# Altium project uz_per_wolfspeed_25kw_FM3.PrjPcb (part 2 of 2)

## Sheet Power.SchDoc
size A4; Organization: UltraZohm; DocumentNumber: 8; SheetNumber: 8; SheetTotal: 11; Website: www.ultrazohm.com
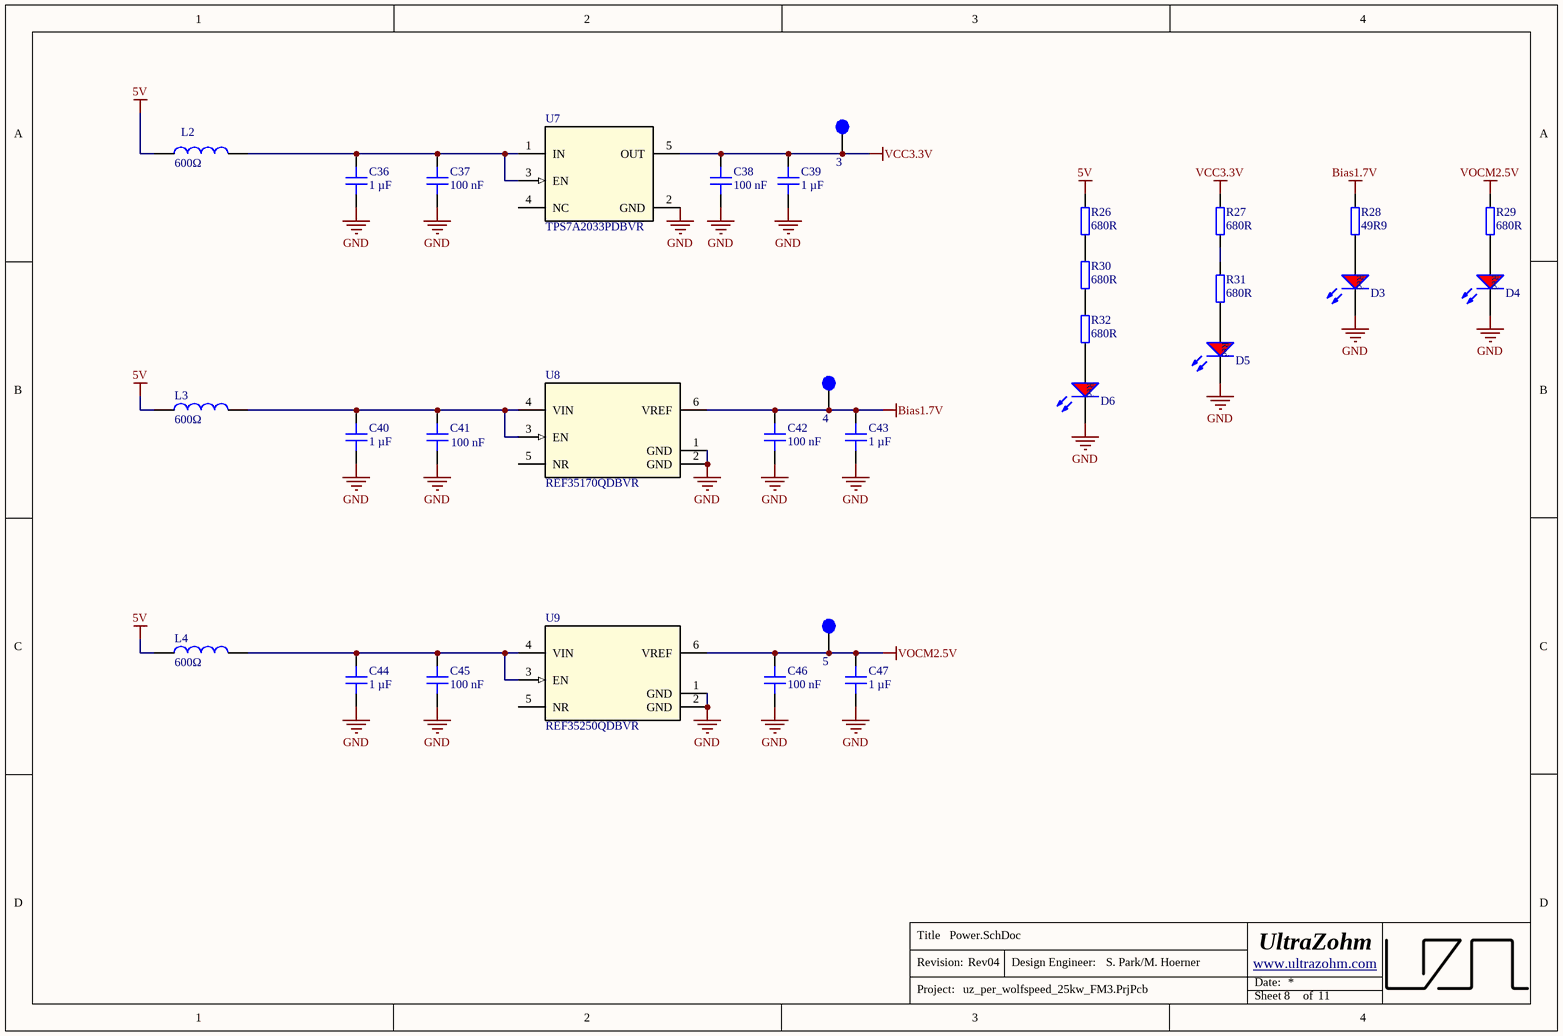
[diagram p6: Power.SchDoc]

### Parts
3  Testpoint 1mm  [TP_1mm]  (value not drawn)  (no BOM)
4  Testpoint 1mm  [TP_1mm]  (value not drawn)  (no BOM)
5  Testpoint 1mm  [TP_1mm]  (value not drawn)  (no BOM)
C36  1 µF  [C_0603]
C37  100 nF  [C_0603]
C38  100 nF  [C_0603]
C39  1 µF  [C_0603]
C40  1 µF  [C_0603]
C41  100 nF  [C_0603]
C42  100 nF  [C_0603]
C43  1 µF  [C_0603]
C44  1 µF  [C_0603]
C45  100 nF  [C_0603]
C46  100 nF  [C_0603]
C47  1 µF  [C_0603]
D3  150060RS75000  [WL-SMCW_0603]  (value not drawn)
D4  150060RS75000  [WL-SMCW_0603]  (value not drawn)
D5  150060RS75000  [WL-SMCW_0603]  (value not drawn)
D6  150060RS75000  [WL-SMCW_0603]  (value not drawn)
L2  600Ω  [WE-CBF_0805_High Current]
L3  600Ω  [WE-CBF_0805_High Current]
L4  600Ω  [WE-CBF_0805_High Current]
R26  680R  [R_0603_N]
R27  680R  [R_0603_N]
R28  49R9  [RES 0603_1608]
R29  680R  [R_0603_N]
R30  680R  [R_0603_N]
R31  680R  [R_0603_N]
R32  680R  [R_0603_N]
U7  TPS7A2033PDBVR  [DBV0005A-IPC_A]
U8  REF35170QDBVR  [DBV0006A-IPC_A]
U9  REF35250QDBVR  [DBV0006A-IPC_A]

### Nets
5V: L2.1 L3.1 L4.1 R26.2
Bias1.7V: 4.1 C42.1 C43.1 R28.1 U8.6(VREF)
GND: C36.2 C37.2 C38.2 C39.2 C40.2 C41.2 C42.2 C43.2 C44.2 C45.2 C46.2 C47.2 D3.1(K) D4.1(K) D5.1(K) D6.1(K) U7.2(GND) U8.1(GND) U8.2(GND) U9.1(GND) U9.2(GND)
VCC3.3V: 3.1 C38.1 C39.1 R27.2 U7.5(OUT)
VOCM2.5V: 5.1 C46.1 C47.1 R29.2 U9.6(VREF)
NetC36_1: C36.1 C37.1 L2.2 U7.1(IN) U7.3(EN)
NetC40_1: C40.1 C41.1 L3.2 U8.3(EN) U8.4(VIN)
NetC44_1: C44.1 C45.1 L4.2 U9.3(EN) U9.4(VIN)
NetD3_2: D3.2(A) R28.2
NetD4_2: D4.2(A) R29.1
NetD5_2: D5.2(A) R31.1
NetD6_2: D6.2(A) R32.1
NetR26_1: R26.1 R30.2
NetR27_1: R27.1 R31.2
NetR30_1: R30.1 R32.2

Not connected (* = marked no-connect by the designer): U7 4(NC); U8 5(NR); U9 5(NR)

### Notes on the sheet
- Title
- Revision:
- Design Engineer:
- Date:
- Project:
- Sheet
- of

### Library data of the parts
3-5 = TP_1mm: Created: 2018_06_25_AGeiger; Value: Testpoint 1mm
C36 C39 C40 C43 C44 C47 = C0603C105K3RAC7411: Capacitor 0603, 25 VDC, 1 µF, X7R; Manufacturer: KEMET; Tolerance: 10 %; Voltage Rating: 25 VDC; Created from: MGremer; Manufacturer Part Number: C0603C105K3RAC7411; PartID: 4; Created On: 20/12/2020 13:54:13; ComponentLink1Description: Datasheet; ComponentLink1URL: https://www.mouser.de/datasheet/2/212/KEM_C1002_X7R_SMD-1102033.pdf; Component Type: Capacitor 0603; Device Package: 0603; Last Updated: 20/12/2020 16:43:05; Mounting Type: SMD; Operating Temperature: -55 - 125°C; Series: SMD Comm X7R; Supplier 1: Mouser; Supplier Part Number 1: 80-C0603C105K3RLR; Type: Capacitor; Value: 1 µF; Live Cycle Status: 1; Stock number: Labor SMD Container; LCSC Part Number: C29936
C37 C38 C41 C42 C45 C46 = C0603C104K5RAC3121: Capacitor 0603, 50 VDC, 100nF, X7R; Manufacturer: KEMET; Tolerance: 10 %; Voltage Rating: 50 VDC; Created from: DHufnagel; Manufacturer Part Number: C0603C104K5RAC3121; PartID: 99; Created On: 11/08/2022 14:33:29; ComponentLink1Description: Datasheet; ComponentLink1URL: https://www.mouser.de/datasheet/2/212/KEM_C1023_X7R_AUTO_SMD-1093309.pdf; Component Type: Capacitor 0603; Device Package: 0603; Last Updated: 19/08/2022 08:26:58; Mounting Type: SMD; Operating Temperature: -55 - 125°C; Series: X7R; Supplier 1: Mouser; Supplier Part Number 1: 80-C603C104K5RAC3121; Supplier 2: LCSC; Supplier Part Number 2: C14663; Type: Capacitor; Value: 100 nF; Live Cycle Status: 1; LCSC Part Number: C14663; Stock number: not stored
D3-D6 = LED_Red_0603: WL-SMCW SMD Mono-color Chip LED Waterclear, size 0603, Red, 2 V, 140°; Forward Voltage: 2 V; Luminous Intensity: 250 mcd; Peak Wavelength: 630 nm; Dominant Wavelength: 625 nm; MF: Wuerth Elektronik; Published Date: Sep. 2017; ComponentLink1Description: Manufacturer; ComponentLink1URL: http://www.we-online.de; ComponentLink2Description: Datasheet; ComponentLink2URL: http://katalog.we-online.com/led/datasheet/150060RS75000.pdf; MPN: 150060RS75000; Size: 0603; Viewing Angle: 140°; Emitting Color: Red; Value: 150060RS75000; Package: 0603; Created: 2018_09_06_AGeiger; Supplier 1: Farnell; Supplier Part Number 1: 2322071; Supplier 2: Mouser; Supplier Part Number 2: 710-150060RS75000; Supplier 3: Digi-Key; Supplier Part Number 3: 732-4978-1-ND; LCSC Part Number: C2286
L2-L4 = WE-CBF, 742792040: WE-CBF SMD EMI Suppression Ferrite Bead, 0805, 600Ω; MF: Wurth Elektronik; Type: High Current; PublishedDate: Aug 2016; ComponentLink1Description: Manufacturer; ComponentLink1URL: http://www.we-online.de; ComponentLink2Description: Datasheet; ComponentLink2URL: http://katalog.we-online.de/pbs/datasheet/742792040.pdf; MPN: 742792040; Value: 600Ω; Package: 0805; Supplier 1: Farnell; Supplier 2: Mouser; Supplier 3: Digi-Key; Supplier Part Number 1: 2761567; Supplier Part Number 2: 710-742792040; Supplier Part Number 3: 732-1620-1-ND; LCSC Part Number: C98308
R26 R27 R29-R32 = R_0603: SMD Resistor 0603; MPN: CR0603-FX-3901ELF; Tolerance: 1%; Voltage: 75V; Power: 100 mW; MF: Bourns; Package: 0603; Value: 680R; Created: 2018_09_06_AGeiger; Supplier 1: Mouser; Supplier Part Number 1: 652-CR0603-FX3901ELF; LCSC Part Number: C23228
R28 = RK73H1JTTD49R9F: SMD resistor 1%; Manufacturer: KOA Speer; Created from: DHufnagel; Manufacturer Part Number: RK73H1JTTD49R9F; PartID: 214; Created On: 14.12.2020 16:17:14; ComponentLink1Description: Datasheet; ComponentLink1URL: https://www.mouser.de/datasheet/2/219/RK73H-1825326.pdf; Component Type: SMD resistor; Device Package: 0603; Last Updated: 27.05.2022 13:46:35; Mounting Type: SMD; Supplier 1: Mouser; Supplier Part Number 1: 660-RK73H1JTTD49R9F; Supplier 2: LCSC; Supplier Part Number 2: C160046; Type: Resistor; Tolerance: 1%; Value: 49R9; Live Cycle Status: 1; Stock number: not stored; LCSC Part Number: C160046
U7 = TPS7A2033PDBVR: No Description Available; Mfr_Name: Texas Instruments; TYPE: TYPE; RefDes: RefDes; LCSC Part Number: C2862740
U8 = REF35170QDBVR: No Description Available; Mfr_Name: Texas Instruments; TYPE: TYPE; RefDes: RefDes; LCSC Part Number: C20345634
U9 = REF35250QDBVR: No Description Available; Mfr_Name: Texas Instruments; TYPE: TYPE; RefDes: RefDes; LCSC Part Number: C6265005

## Sheet DCVoltageConditioning.SchDoc
size A4; Organization: UltraZohm; DocumentNumber: 4; SheetNumber: 4; SheetTotal: 11; Website: www.ultrazohm.com
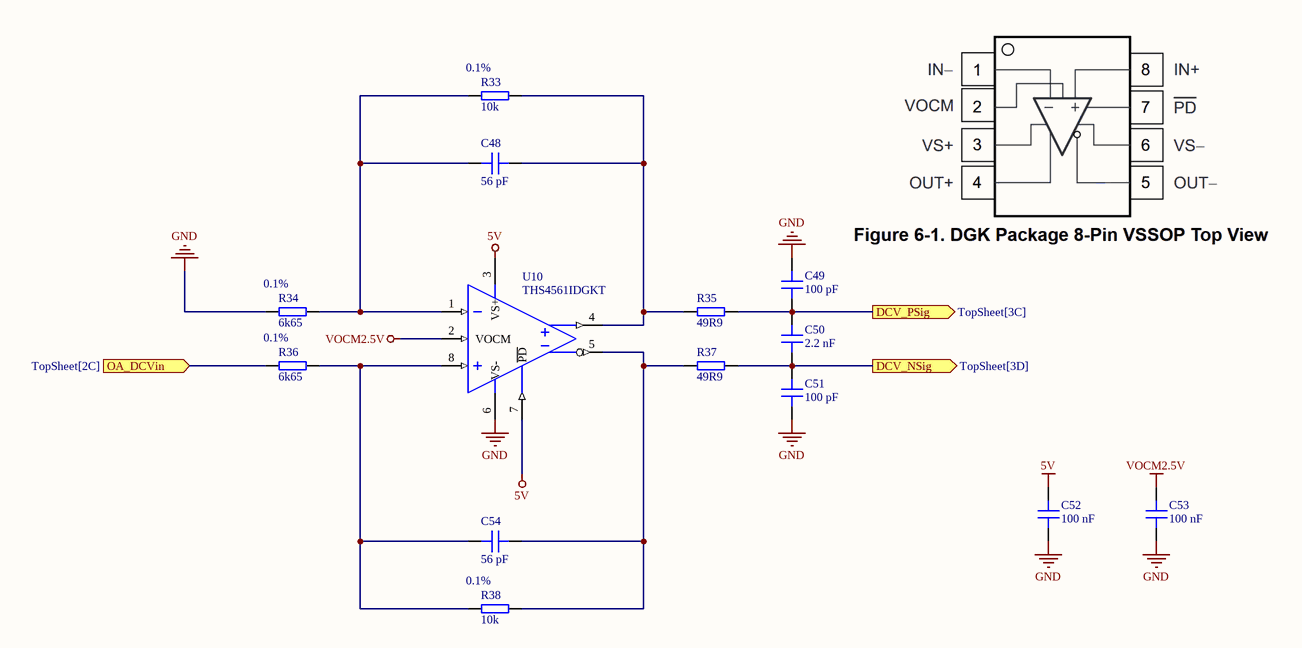
[diagram p7: DCVoltageConditioning.SchDoc]

### Parts
C48  56 pF  [C_0603]
C49  100 pF  [C_0603_TE]
C50  2.2 nF  [C_0603]
C51  100 pF  [C_0603_TE]
C52  100 nF  [C_0603]
C53  100 nF  [C_0603]
C54  56 pF  [C_0603]
R33  10k  Tolerance: 0.1%  [RES 0603_1608]
R34  6k65  Tolerance: 0.1%  [RES 0603_1608]
R35  49R9  [RES 0603_1608]
R36  6k65  Tolerance: 0.1%  [RES 0603_1608]
R37  49R9  [RES 0603_1608]
R38  10k  Tolerance: 0.1%  [RES 0603_1608]
U10  THS4561IDGKT  [SOP65P490X110-8N]

### Ports
DCV_NSig (out, see TopSheet[3D]), DCV_PSig (out, see TopSheet[3C]), OA_DCVin (in, see TopSheet[2C])

### Nets
5V: C52.1 U10.3(VS+) U10.7(~{PD})
GND: C49.1 C51.2 C52.2 C53.2 R34.1 U10.6(VS-)
VOCM2.5V: C53.1 U10.2(VOCM)
AnSig4_N: C50.2 C51.1 R37.2 ; port DCV_NSig
AnSig4_P: C49.2 C50.1 R35.2 ; port DCV_PSig
OpAinSig4: R36.1 ; port OA_DCVin
NetC48_1: C48.1 R33.1 R34.2 U10.1(VIN-)
NetC48_2: C48.2 R33.2 R35.1 U10.4(VOUT+)
NetC54_1: C54.1 R36.2 R38.1 U10.8(VIN+)
NetC54_2: C54.2 R37.1 R38.2 U10.5(VOUT-)

### Notes on the sheet
- Title
- Revision:
- Design Engineer:
- Date:
- Project:
- Sheet
- of

### Library data of the parts
C48 C54 = CL10C560JB8NNNC: Capacitor 0603, 50 VDC, 56 pF, C0G; Manufacturer: Samsung Electro-Mechanics; Tolerance: 5 %; Voltage Rating: 50 VDC; Created from: DHufnagel; Manufacturer Part Number: CL10C560JB8NNNC; PartID: 92; Created On: 20/12/2020 13:54:13; ComponentLink1Description: Datasheet; ComponentLink1URL: https://www.mouser.de/datasheet/2/585/MLCC-1837944.pdf; Component Type: Capacitor 0603; Device Package: 0603; Last Updated: 20/12/2020 16:24:16; Mounting Type: SMD; Operating Temperature: -55 - 125°C; Series: CL; Supplier 1: Mouser; Supplier Part Number 1: 187-CL10C560JB8NNNC; Supplier 2: LCSC; Supplier Part Number 2: C39148; Type: Capacitor; Value: 56 pF; Live Cycle Status: 1; LCSC Part Number: C39148; Stock number: not stored
C49 C51 = CL10C101JB8NNNC: 50V 100pF C0G ±5% 0603 Multilayer Ceramic Capacitors MLCC - SMD/SMT ROHS; Manufacturer: Samsung Electro-Mechanics; Voltage Rating: 50 VDC; Created from: AGeiger; Manufacturer Part Number: CL10C101JB8NNNC; PartID: 106; Created On: 03/09/2022 10:55:28; ComponentLink1Description: Datasheet; ComponentLink1URL: https://datasheet.lcsc.com/lcsc/1811151136_Samsung-Electro-Mechanics-CL10C101JB8NNNC_C14858.pdf; Component Type: Capacitor 0603; Device Package: 0603; Last Updated: 08/08/2024 13:37:35; Mounting Type: SMD; Operating Temperature: -55 - 125°C; Series: C0G; Supplier 1: LCSC; Supplier Part Number 1: C14858; Supplier 2: Mouser; Supplier Part Number 2: 187-CL10C101JB8NNNC; Type: Capacitor; Tolerance: 5 %; Value: 100 pF; Live Cycle Status: 1; LCSC Part Number: C14858
C50 = 06035C222JAT2A: Capacitor 0603, 50 VDC, 2.2 nF, X7R; Manufacturer: AVX; Tolerance: 5 %; Voltage Rating: 50 VDC; Created from: MGremer; Manufacturer Part Number: 06035C222JAT2A; PartID: 77; Created On: 20/12/2020 13:54:13; ComponentLink1Description: Datasheet; ComponentLink1URL: https://www.mouser.de/datasheet/2/40/X7RDielectric-777024.pdf; Component Type: Capacitor 0603; Device Package: 0603; Last Updated: 15/02/2023 17:14:22; Mounting Type: SMD; Operating Temperature: -55 - 125°C; Series: MLCC X7R; Supplier 1: Mouser; Supplier Part Number 1: 581-06035C222J; Supplier 2: LCSC; Supplier Part Number 2: C86023; Type: Capacitor; Value: 2.2 nF; Live Cycle Status: 1; Stock number: not stored; LCSC Part Number: C93190
C52 C53 = C0603C104K5RAC3121: as C37 on sheet Power; Manufacturer Part Number: C0603C104K5RAC3121; PartID: 99; Created On: 11/08/2022 14:33:29; ComponentLink1Description: Datasheet; ComponentLink1URL: https://www.mouser.de/datasheet/2/212/KEM_C1023_X7R_AUTO_SMD-1093309.pdf; Component Type: Capacitor 0603; Device Package: 0603; Last Updated: 19/08/2022 08:26:58; Mounting Type: SMD; Operating Temperature: -55 - 125°C; Series: X7R; Supplier 1: Mouser; Supplier Part Number 1: 80-C603C104K5RAC3121; Supplier 2: LCSC; Supplier Part Number 2: C14663; Type: Capacitor; Value: 100 nF; Live Cycle Status: 1; LCSC Part Number: C14663; Stock number: not stored
R33 R38 = ERA-3ARB103V: SMD resistor 0.1%, 10ppm; Manufacturer: Panasonic; Created from: DHufnagel; Manufacturer Part Number: ERA-3ARB103V; PartID: 217; Created On: 14/12/2020 16:17:14; ComponentLink1Description: Datasheet; ComponentLink1URL: https://www.mouser.de/datasheet/2/315/AOA0000C307-1149632.pdf; Component Type: SMD resistor; Device Package: 0603; Last Updated: 25/07/2022 10:07:28; Mounting Type: SMD; Supplier 1: Mouser; Supplier Part Number 1: 667-ERA-3ARB103V; Type: Resistor; Value: 10k; Live Cycle Status: 1; Stock number: not stored; LCSC Part Number: C860067
R34 R36 = RT0603BRD076K65L: 100mW Thin Film Resistor ±25ppm/℃ ±0.1% 6.65kΩ 0603 Chip Resistor - Surface Mount ROHS; Manufacturer: YAGEO; Created from: SPark; Manufacturer Part Number: RT0603BRD076K65L; PartID: 361; Created On: 30/01/2025 15:18:29; ComponentLink1Description: Datasheet; ComponentLink1URL: https://wmsc.lcsc.com/wmsc/upload/file/pdf/v2/lcsc/2210190000_YAGEO-RT0603BRD076K65L_C861536.pdf; Component Type: SMD resistor; Device Package: 0603; Last Updated: 30/01/2025 15:27:22; Mounting Type: SMD; Supplier 1: LCSC/JLCPCB; Supplier Part Number 1: C861536; Type: Resistor; Value: 6k65; Live Cycle Status: 1; LCSC Part Number: C861536
R35 R37 = RK73H1JTTD49R9F: as R28 on sheet Power; Manufacturer Part Number: RK73H1JTTD49R9F; PartID: 214; Created On: 14/12/2020 16:17:14; ComponentLink1Description: Datasheet; ComponentLink1URL: https://www.mouser.de/datasheet/2/219/RK73H-1825326.pdf; Component Type: SMD resistor; Device Package: 0603; Last Updated: 27/05/2022 13:46:35; Mounting Type: SMD; Supplier 1: Mouser; Supplier Part Number 1: 660-RK73H1JTTD49R9F; Supplier 2: LCSC; Supplier Part Number 2: C160046; Type: Resistor; Tolerance: 1%; Value: 49R9; Live Cycle Status: 1; Stock number: not stored; LCSC Part Number: C160046
U10 = THS4561IDGKT: Fully Differential Amplifier, Low-Power, High Supply Range, 60-MHz; Manufacturer: Texas Instruments; Channels: 1; GBP: 68 MHz; CMRR: 110 dB; Value: Rail-to-Rail; Created from: DHufnagel; Manufacturer Part Number: THS4561IDGKT; PartID: 13; Created On: 08/07/2022 14:29:07; ComponentLink1Description: Datasheet; ComponentLink1URL: https://www.ti.com/general/docs/suppproductinfo.tsp?distId=26&gotoUrl=https://www.ti.com/lit/gpn/ths4561; Component Type: Differential Amplifier; Device Package: VSSOP-8; Last Updated: 30/09/2024 15:54:43; Mounting Type: SMD; Operating Temperature: -40 to +125 °C; Series: THS4561; Supplier 1: Mouser; Supplier Part Number 1: 595-THS4561IDGKT; Supplier 2: Digi-Key; Supplier Part Number 2: 296-THS4561IDGKTCT-ND; Type: Differential Amplifiers; Live Cycle Status: 1; Stock number: not stored; LCSC Part Number: C2860980

## Sheet GateAndFanControl.SchDoc
size A4; Organization: UltraZohm; DocumentNumber: 5; SheetNumber: 9; SheetTotal: 11; Website: www.ultrazohm.com
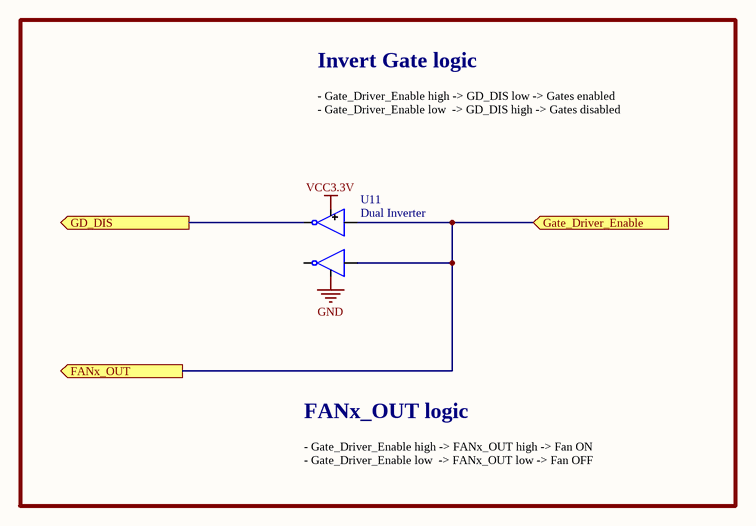
[diagram p8: GateAndFanControl.SchDoc]

### Parts
U11  Dual Inverter  [SN74LVC2GU04DCKR]

### Ports
FANx_OUT (out, see TopSheet[1D]), Gate_Driver_Enable (in, see TopSheet[1D], OvercurrentDetectionLogic[3A]), GD_DIS (out, see TopSheet[1D], Connector_Inverter[2C])

### Nets
GND: U11.2(GND)
VCC3.3V: U11.5(VCC)
FANx_OUT: U11.1(IN1) U11.3(IN2) ; port Gate_Driver_Enable, port FANx_OUT
GD_DIS: U11.6(OUT2) ; port GD_DIS

Not connected (* = marked no-connect by the designer): U11 4(OUT2)

### Notes on the sheet
- Invert Gate logic
- - Gate_Driver_Enable high -> GD_DIS low -> Gates enabled
  - Gate_Driver_Enable low  -> GD_DIS high -> Gates disabled
- FANx_OUT logic
- - Gate_Driver_Enable high -> FANx_OUT high -> Fan ON
  - Gate_Driver_Enable low  -> FANx_OUT low -> Fan OFF
- Title
- Revision:
- Design Engineer:
- Date:
- Project:
- Sheet
- of

### Library data of the parts
U11 = SN74LVC2GU04DCKR: This dual inverter is designed for 1.65-V to 5.5-V VCC / operation.; JLCSMT Rotation: 180; LCSC Part Number: C116660

## Sheet OvercurrentDetectionLogic.SchDoc
size A4; Organization: UltraZohm; DocumentNumber: 7; SheetNumber: 10; SheetTotal: 11; Website: www.ultrazohm.com
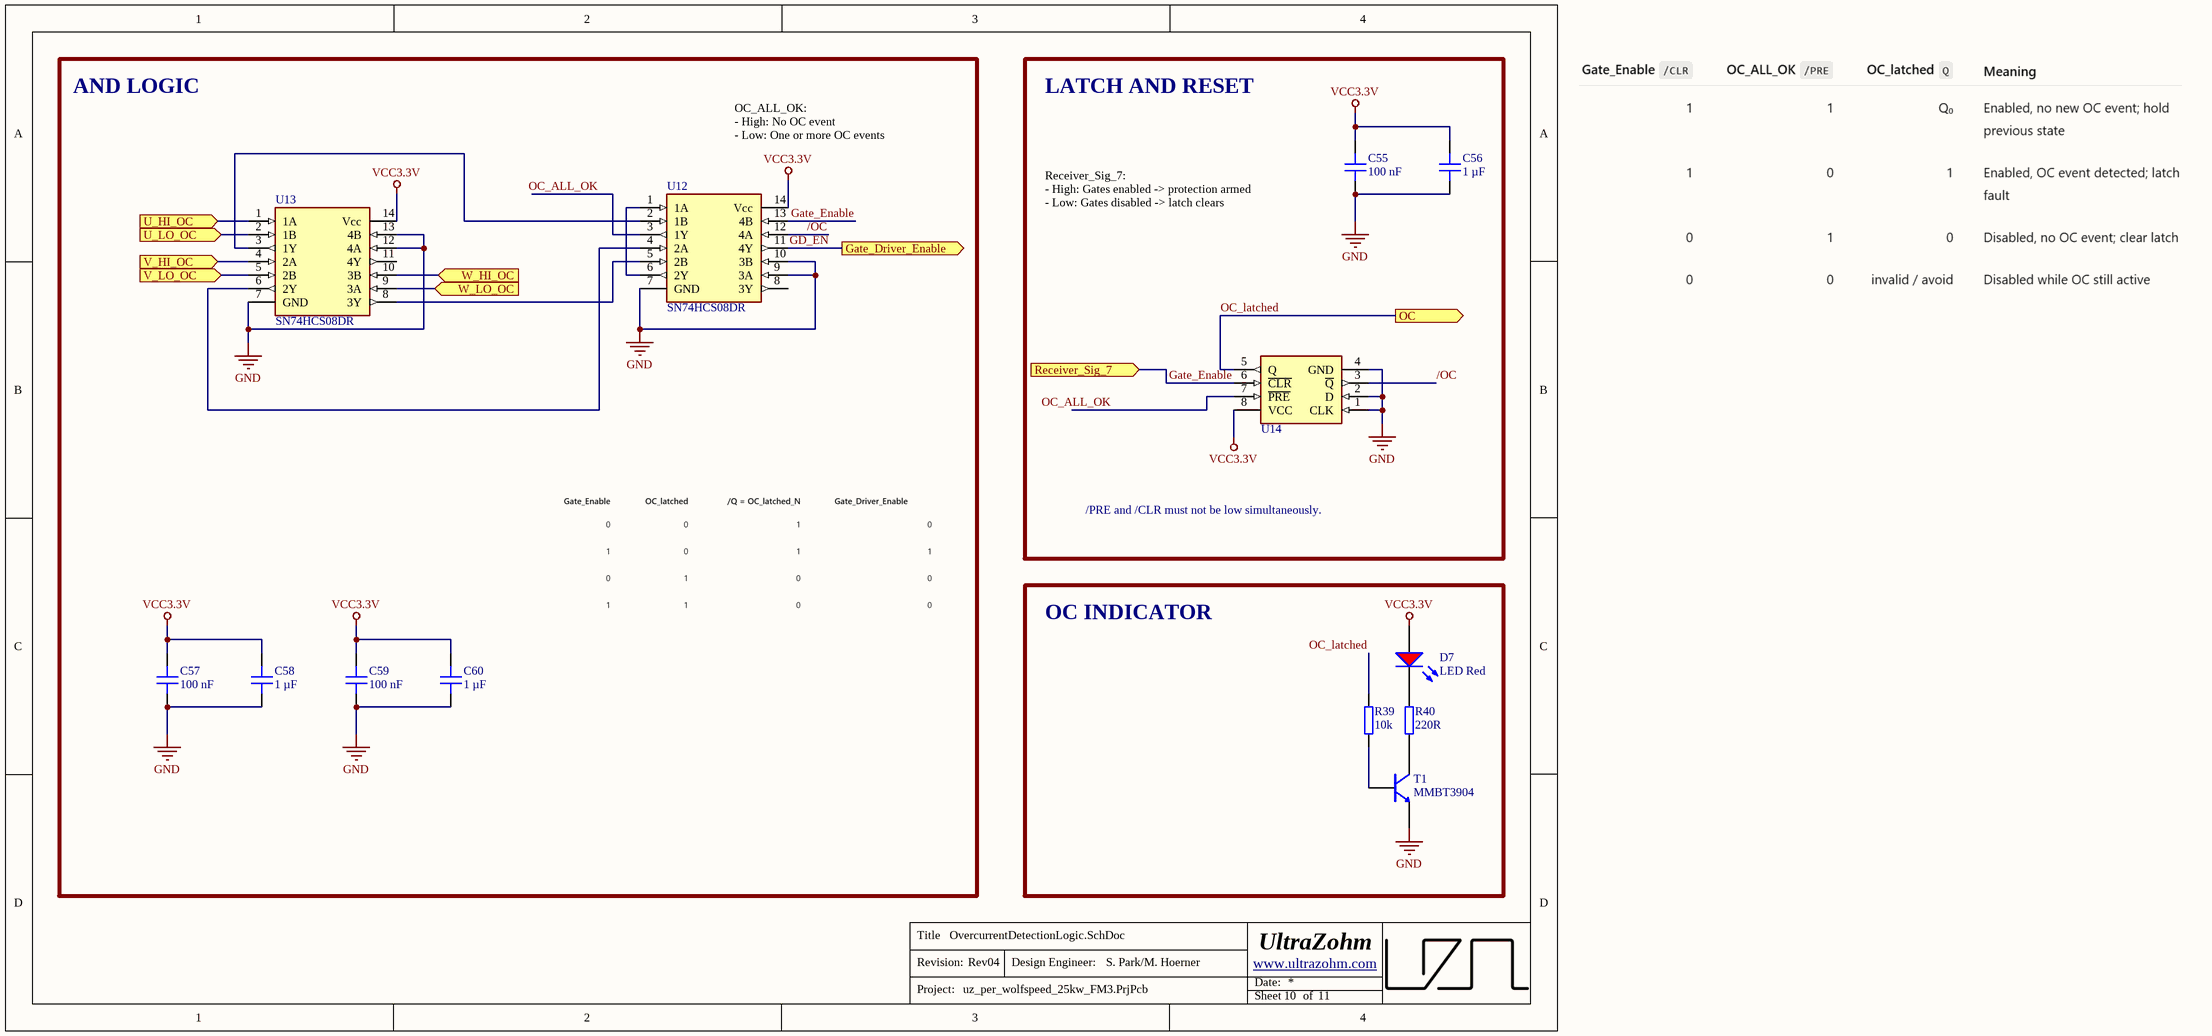
[diagram p9: OvercurrentDetectionLogic.SchDoc]

### Parts
C55  100 nF  [C_0603]
C56  1 µF  [C_0603]
C57  100 nF  [C_0603]
C58  1 µF  [C_0603]
C59  100 nF  [C_0603]
C60  1 µF  [C_0603]
D7  LED Red  [LEDM2012X80N]
R39  10k  [RES 0603_1608]
R40  220R  [RES 0603_1608]
T1  MMBT3904  [SOT95P280X145-3N]
U12  SN74HCS08DR  [SOIC127P600X175-14N]
U13  SN74HCS08DR  [SOIC127P600X175-14N]
U14  SN74LVC1G74DCTR  [MSOP-8]  (value not drawn)

### Blocks framed on the sheet
AND LOGIC: C57-C60 U12 U13
LATCH AND RESET: C55 C56 U14
OC INDICATOR: D7 R39 R40 T1

### Ports
Gate_Driver_Enable (out, see TopSheet[3B], GateAndFanControl[2B]), OC (out, see TopSheet[3B]), Receiver_Sig_7 (in, see TopSheet[2B]), U_HI_OC (in, see TopSheet[2B], OvercurrentDetection[2B]), U_LO_OC (in, see TopSheet[2B], OvercurrentDetection[2C]), V_HI_OC (in, see TopSheet[2B], OvercurrentDetection[4A]), V_LO_OC (in, see TopSheet[2B], OvercurrentDetection[4B]), W_HI_OC (in, see TopSheet[2B], OvercurrentDetection[4C]), W_LO_OC (in, see TopSheet[2B], OvercurrentDetection[4D])

### Nets
GND: C55.2 C56.2 C57.2 C58.2 C59.2 C60.2 T1.2(EMITTER) U12.7(GND) U12.9(3A) U12.10(3B) U13.7(GND) U13.12(4A) U13.13(4B) U14.1(CLK) U14.2(D) U14.4(GND)
VCC3.3V: C55.1 C56.1 C57.1 C58.1 C59.1 C60.1 D7.2(A) U12.14(Vcc) U13.14(Vcc) U14.8(VCC)
/OC: U12.12(4A) U14.3(~{Q})
Gate_Enable: U12.13(4B) U14.6(~{CLR}) ; port Receiver_Sig_7
GD_EN: U12.11(4Y) ; port Gate_Driver_Enable  [project net FANx_OUT]
OC_ALL_OK: U12.3(1Y) U14.7(~{PRE})
OC_latched: R39.2 U14.5(Q) ; port OC
U_HI_OC: U13.1(1A) ; port U_HI_OC
U_LO_OC: U13.2(1B) ; port U_LO_OC
V_HI_OC: U13.4(2A) ; port V_HI_OC
V_LO_OC: U13.5(2B) ; port V_LO_OC
W_HI_OC: U13.10(3B) ; port W_HI_OC
W_LO_OC: U13.9(3A) ; port W_LO_OC
NetD7_1: D7.1(K) R40.2
NetR39_1: R39.1 T1.1(BASIS)
NetR40_1: R40.1 T1.3(COLLECTOR)
NetU12_1: U12.1(1A) U12.6(2Y)
NetU12_2: U12.2(1B) U13.3(1Y)
NetU12_4: U12.4(2A) U13.6(2Y)
NetU12_5: U12.5(2B) U13.8(3Y)

Not connected (* = marked no-connect by the designer): U12 8(3Y); U13 11(4Y)

### Notes on the sheet
- OC_ALL_OK:
  - High: No OC event
  - Low: One or more OC events
- Receiver_Sig_7:
  - High: Gates enabled -> protection armed
  - Low: Gates disabled -> latch clears
- /PRE and /CLR must not be low simultaneously.
- Title
- Revision:
- Design Engineer:
- Date:
- Project:
- Sheet
- of

### Library data of the parts
C55 C57 C59 = C0603C104K5RAC3121: as C37 on sheet Power; Manufacturer Part Number: C0603C104K5RAC3121; PartID: 99; Created On: 11/08/2022 14:33:29; ComponentLink1Description: Datasheet; ComponentLink1URL: https://www.mouser.de/datasheet/2/212/KEM_C1023_X7R_AUTO_SMD-1093309.pdf; Component Type: Capacitor 0603; Device Package: 0603; Last Updated: 19/08/2022 08:26:58; Mounting Type: SMD; Operating Temperature: -55 - 125°C; Series: X7R; Supplier 1: Mouser; Supplier Part Number 1: 80-C603C104K5RAC3121; Supplier 2: LCSC; Supplier Part Number 2: C14663; Type: Capacitor; Value: 100 nF; Live Cycle Status: 1; LCSC Part Number: C14663; Stock number: not stored
C56 C58 C60 = C0603C105K3RAC7411: as C36 on sheet Power; Manufacturer Part Number: C0603C105K3RAC7411; PartID: 4; Created On: 20/12/2020 13:54:13; ComponentLink1Description: Datasheet; ComponentLink1URL: https://www.mouser.de/datasheet/2/212/KEM_C1002_X7R_SMD-1102033.pdf; Component Type: Capacitor 0603; Device Package: 0603; Last Updated: 20/12/2020 16:43:05; Mounting Type: SMD; Operating Temperature: -55 - 125°C; Series: SMD Comm X7R; Supplier 1: Mouser; Supplier Part Number 1: 80-C0603C105K3RLR; Type: Capacitor; Value: 1 µF; Live Cycle Status: 1; Stock number: Labor SMD Container; LCSC Part Number: C29936
D7 = UZgen_LED_0805_Red: Standard LEDs - SMD 0805 red; Manufacturer: UZgen; Created from: UZgenTool; Manufacturer Part Number: UZgen_LED_0805_Red; PartID: 28; Created On: 09.09.2024 10:45:01; ComponentLink1Description: N/A; ComponentLink1URL: N/A; Component Type: LED Diode; Device Package: 0805; Last Updated: 09.09.2024 10:45:01; Mounting Type: SMD; Supplier 1: LCSC; Supplier Part Number 1: =LCSC Part Number; Type: Standard; Value: LED Red; Live Cycle Status: 1; Stock number: not stored; Color: red
R39 = RK73B1JTTD103J: SMD resistor E24 series; Manufacturer: KOA Speer; Tolerance: 5%; Created from: MGremer; Manufacturer Part Number: RK73B1JTTD103J; PartID: 98; Created On: 14.12.2020 16:17:14; ComponentLink1Description: Datasheet; ComponentLink1URL: https://www.mouser.de/datasheet/2/219/RK73B-1825463.pdf; Component Type: SMD resistor; Device Package: 0603; Last Updated: 27.05.2022 14:04:22; Mounting Type: SMD; Supplier 1: Mouser; Supplier Part Number 1: 660-RK73B1JTTD103J; Type: Resistor; Value: 10k; Live Cycle Status: 1; Stock number: Labor SMD Container; LCSC Part Number: C25804
R40 = RK73B1JTTDD221J: SMD resistor E24 series; Manufacturer: KOA Speer; Tolerance: 5%; Created from: MGremer; Manufacturer Part Number: RK73B1JTTDD221J; PartID: 58; Created On: 14.12.2020 16:17:14; ComponentLink1Description: Datasheet; ComponentLink1URL: https://www.mouser.de/datasheet/2/219/RK73B-1825463.pdf; Component Type: SMD resistor; Device Package: 0603; Last Updated: 02.03.2021 14:07:32; Mounting Type: SMD; Supplier 1: Mouser; Supplier Part Number 1: 660-RK73B1JTTDD221J; Type: Resistor; Value: 220R; Live Cycle Status: 1; Stock number: Labor SMD Container
T1 = MMBT3904: Bipolartransistor, 40V 200mW 200mA 100@10mA,1V 300MHz 300mV@50mA,5mA NPN +150℃@(Tj) SOT-23(SOT-23-3); Manufacturer: Jiangsu Changjing Electronics Technology Co., Ltd.; Number Of Channels: single; Collector Basis Voltage: 60 V; Created from: NDiringer; Manufacturer Part Number: MMBT3904; PartID: 2; Created On: 10.06.2022 12:04:49; ComponentLink1Description: Datasheet; ComponentLink1URL: https://datasheet.lcsc.com/lcsc/1811011934_Jiangsu-Changjing-Electronics-Technology-Co---Ltd--MMBT3904_C20526.pdf; Component Type: Bipolartransistor; Device Package: SOT-23-3; Last Updated: 10.08.2022 13:48:16; Mounting Type: SMD; Operating Temperature: -55 - 150 °C; Series: MMBT3904; Supplier 1: Mouser; Supplier Part Number 1: MMBT3904; Supplier 2: LCSC/JLCPCB; Supplier Part Number 2: C20526; Type: Bipolartransistor; Collector Emitter Voltage: 40 V; Polarization: NPN; Power Dissipation: 200 mW; Value: 40 V; Live Cycle Status: 1; LCSC Part Number: C20526
U12 U13 = SN74HCS08DR: Logische Gatter 4-ch 2-input 2-V to 6-V high-speed; Manufacturer: Texas Instruments; Value: 2 - 6 V; Created from: FRosner; Manufacturer Part Number: SN74HCS08DR; PartID: 11; Created On: 22.06.2026 16:12:32; ComponentLink1Description: Datasheet; ComponentLink1URL: https://www.ti.com/lit/ds/symlink/sn74hcs08.pdf?ts=1782076450125; Component Type: AND; Device Package: SOIC-14; Last Updated: 22.06.2026 16:23:25; Mounting Type: SMD; Operating Temperature: -40 to +125 °C; Series: SN74HCS08; Supplier 1: Mouser; Supplier Part Number 1: 595-SN74HCS08DR; Supplier 2: LCSC; Supplier Part Number 2: C2868021; Type: AND; Live Cycle Status: 1; Stock number: not stored; LCSC Part Number: C2868021
U14 = SN74LVC1G74DCTR: Single Positive-Edge-Triggered D-Type Flip-Flop with Clear and Preset; Manufacturer: Texas Instruments; Created from: FRosner; Manufacturer Part Number: SN74LVC1G74DCTR; PartID: 22; Created On: 11.06.2026 11:01:37; ComponentLink1Description: Datasheet; ComponentLink1URL: https://www.ti.com/lit/ds/symlink/sn74lvc1g74.pdf?ts=1781141639063; Component Type: Flip-Flops; Device Package: MSOP-8; Last Updated: 19.06.2026 11:11:41; Mounting Type: SMD; Operating Temperature: -40 - +125 °C; Supplier 1: LCSC; Supplier Part Number 1: C840104; Type: Flip-Flops; Live Cycle Status: 1; LCSC Part Number: C840104; Stock number: not stored

## Sheet TempSenseConditioning.SchDoc
size A4; Organization: UltraZohm; DocumentNumber: 5; SheetNumber: 11; SheetTotal: 11; Website: www.ultrazohm.com
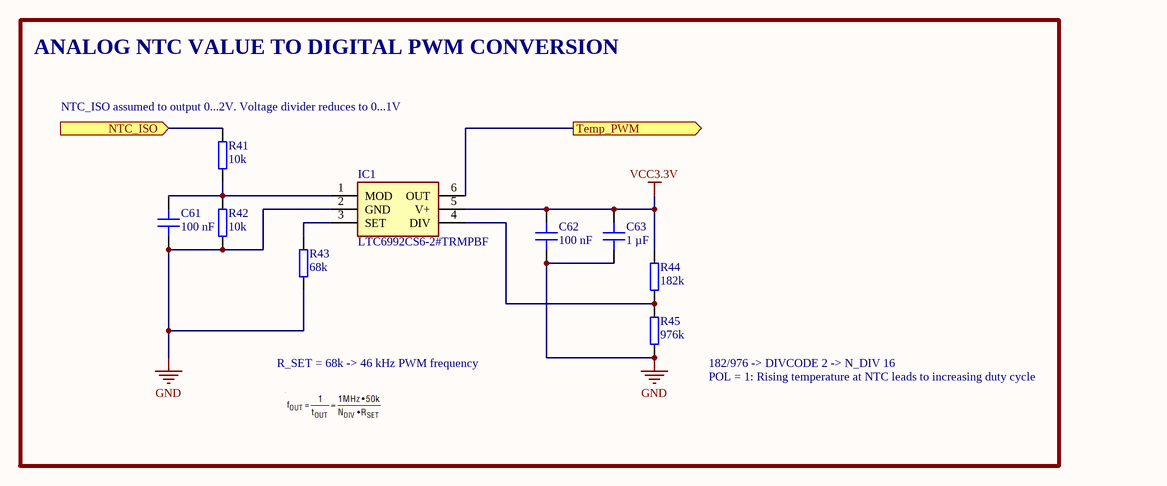
[diagram p10: TempSenseConditioning.SchDoc]

### Parts
C61  100 nF  [C_0603]
C62  100 nF  [C_0603]
C63  1 µF  [C_0603]
IC1  LTC6992CS6-2#TRMPBF  [SOT95P280X100-6N]
R41  10k  [RES 0603_1608]
R42  10k  [RES 0603_1608]
R43  68k  [RES 0603_1608]
R44  182k  [RES 0603_1608]
R45  976k  [RES 0603_1608]

### Ports
NTC_ISO (in, see TopSheet[2C], Connector_Inverter[2B]), Temp_PWM (out, see TopSheet[2C])

### Nets
GND: C61.2 C62.2 C63.2 IC1.2(GND) R42.1 R43.1 R45.1
VCC3.3V: C62.1 C63.1 IC1.5(V+) R44.2
TempSenseAnalog: R41.2 ; port NTC_ISO
TransmitterSig1: IC1.6(OUT) ; port Temp_PWM
NetC61_1: C61.1 IC1.1(MOD) R41.1 R42.2
NetIC1_3: IC1.3(SET) R43.2
NetIC1_4: IC1.4(DIV) R44.1 R45.2

### Notes on the sheet
- ANALOG NTC VALUE TO DIGITAL PWM CONVERSION
- (near R41) NTC_ISO assumed to output 0...2V. Voltage divider reduces to 0...1V
- R_SET = 68k -> 46 kHz PWM frequency
- 182/976 -> DIVCODE 2 -> N_DIV 16
- POL = 1: Rising temperature at NTC leads to increasing duty cycle
- Title
- Revision:
- Design Engineer:
- Date:
- Project:
- Sheet
- of

### Library data of the parts
C61 C62 = C0603C104K5RAC3121: as C37 on sheet Power; Manufacturer Part Number: C0603C104K5RAC3121; PartID: 99; Created On: 11/08/2022 14:33:29; ComponentLink1Description: Datasheet; ComponentLink1URL: https://www.mouser.de/datasheet/2/212/KEM_C1023_X7R_AUTO_SMD-1093309.pdf; Component Type: Capacitor 0603; Device Package: 0603; Last Updated: 19/08/2022 08:26:58; Mounting Type: SMD; Operating Temperature: -55 - 125°C; Series: X7R; Supplier 1: Mouser; Supplier Part Number 1: 80-C603C104K5RAC3121; Supplier 2: LCSC; Supplier Part Number 2: C14663; Type: Capacitor; Value: 100 nF; Live Cycle Status: 1; LCSC Part Number: C14663; Stock number: not stored
C63 = C0603C105K3RAC7411: as C36 on sheet Power; Manufacturer Part Number: C0603C105K3RAC7411; PartID: 4; Created On: 20/12/2020 13:54:13; ComponentLink1Description: Datasheet; ComponentLink1URL: https://www.mouser.de/datasheet/2/212/KEM_C1002_X7R_SMD-1102033.pdf; Component Type: Capacitor 0603; Device Package: 0603; Last Updated: 20/12/2020 16:43:05; Mounting Type: SMD; Operating Temperature: -55 - 125°C; Series: SMD Comm X7R; Supplier 1: Mouser; Supplier Part Number 1: 80-C0603C105K3RLR; Type: Capacitor; Value: 1 µF; Live Cycle Status: 1; Stock number: Labor SMD Container; LCSC Part Number: C29936
IC1 = LTC6992CS6-2#TRMPBF: Switching Controllers PWM with 5% to 95% Pulse Width Control; Manufacturer: Analog Devices; Created from: MHoerner; Manufacturer Part Number: LTC6992CS6-2#TRMPBF; PartID: 12; Created On: 11.06.2026 14:34:57; ComponentLink1Description: Datasheet; ComponentLink1URL: https://www.mouser.de/datasheet/2/609/LTC6992-1-6992-2-6992-3-6992-4-1852873.pdf; Component Type: Switching Controllers; Device Package: SOT-23-6; Last Updated: 11.06.2026 14:34:57; Mounting Type: SMD; Operating Temperature: 0 to 70 °C; Supplier 1: Mouser; Supplier Part Number 1: 584-C6992CS6-2TRMPBF; Supplier 2: LCSC; Supplier Part Number 2: C581035; Type: Switching Controller; Live Cycle Status: 1; LCSC Part Number: C581035; Stock number: not stored
R41 R42 = RK73B1JTTD103J: as R39 on sheet OvercurrentDetectionLogic; Manufacturer Part Number: RK73B1JTTD103J; PartID: 98; Created On: 14.12.2020 16:17:14; ComponentLink1Description: Datasheet; ComponentLink1URL: https://www.mouser.de/datasheet/2/219/RK73B-1825463.pdf; Component Type: SMD resistor; Device Package: 0603; Last Updated: 27.05.2022 14:04:22; Mounting Type: SMD; Supplier 1: Mouser; Supplier Part Number 1: 660-RK73B1JTTD103J; Type: Resistor; Value: 10k; Live Cycle Status: 1; Stock number: Labor SMD Container; LCSC Part Number: C25804
R43 = AC0603FR-1068KL: SMD resistor 1%; Manufacturer: Yageo; Created from: MGremer; Manufacturer Part Number: AC0603FR-1068KL; PartID: 183; Created On: 14.12.2020 16:17:14; ComponentLink1Description: Datasheet; ComponentLink1URL: https://www.mouser.de/datasheet/2/447/PYu_AC_51_RoHS_L_7-1714230.pdf; Component Type: SMD resistor; Device Package: 0603; Last Updated: 21.05.2021 10:06:00; Mounting Type: SMD; Supplier 1: Mouser; Supplier Part Number 1: 603-AC0603FR-1068KL; Type: Resistor; Tolerance: 1%; Value: 68k; Live Cycle Status: 1; Stock number: not stored
R44 = CR0603-FX-1823ELF: SMD resistor 1%, 50V, 100ppm; Manufacturer: Bourns; Created from: DHufnagel; Manufacturer Part Number: CR0603-FX-1823ELF; PartID: 235; Created On: 25.07.2022 08:26:35; ComponentLink1Description: Datasheet; ComponentLink1URL: https://www.mouser.de/datasheet/2/54/cr-1858361.pdf; Component Type: SMD resistor; Device Package: 0603; Last Updated: 15.02.2023 18:09:14; Mounting Type: SMD; Supplier 1: Mouser; Supplier Part Number 1: 652-CR0603FX-1823ELF; Type: Resistor; Tolerance: 1%; Value: 182k; Live Cycle Status: 1; Stock number: not stored; LCSC Part Number: C203368
R45 = CR0603-FX-9763ELF: SMD resistor 1%, 50V, 100ppm; Manufacturer: Bourns; Created from: DHufnagel; Manufacturer Part Number: CR0603-FX-9763ELF; PartID: 234; Created On: 25.07.2022 08:26:35; ComponentLink1Description: Datasheet; ComponentLink1URL: https://www.mouser.de/datasheet/2/54/cr-1858361.pdf; Component Type: SMD resistor; Device Package: 0603; Last Updated: 15.02.2023 18:14:05; Mounting Type: SMD; Supplier 1: Mouser; Supplier Part Number 1: 652-CR0603FX-9763ELF; Type: Resistor; Tolerance: 1%; Value: 976k; Live Cycle Status: 1; Stock number: not stored; LCSC Part Number: C162980

## Nets that join several sheets
5V: Connector_Inverter (9 pins), OA_CC1 (C10A.1 U1A.3 U1A.7), OA_CC2 (C10B.1 U1B.3 U1B.7), OA_CC3 (C10C.1 U1C.3 U1C.7), Power (L2.1 L3.1 L4.1 R26.2), DCVoltageConditioning (C52.1 U10.3 U10.7)
Bias1.7V: OA_CC1 (R3A.1), OA_CC2 (R3B.1), OA_CC3 (R3C.1), Power (5 pins)
GND: TopSheet (R1.1), Connector_Inverter (23 pins), OA_CC1 (5 pins), OA_CC2 (5 pins), OA_CC3 (5 pins), T1 (C15A.2 C16A.2 R13A.2 U3A.2), T2 (C15B.2 C16B.2 R13B.2 U3B.2), OvercurrentDetection (23 pins), R1 (5 pins), R2 (5 pins), R3 (5 pins), R4 (5 pins), R5 (5 pins), R6 (5 pins), R7 (5 pins), Power (21 pins), DCVoltageConditioning (6 pins), GateAndFanControl (U11.2), OvercurrentDetectionLogic (16 pins), TempSenseConditioning (7 pins)
VCC3.3V: Connector_Inverter (X2.05 X2.06), T1 (6 pins), T2 (6 pins), OvercurrentDetection (12 pins), R1 (5 pins), R2 (5 pins), R3 (5 pins), R4 (5 pins), R5 (5 pins), R6 (5 pins), R7 (5 pins), Power (5 pins), GateAndFanControl (U11.5), OvercurrentDetectionLogic (10 pins), TempSenseConditioning (C62.1 C63.1 IC1.5 R44.2)
VOCM2.5V: OA_CC1 (C11A.1 U1A.2), OA_CC2 (C11B.1 U1B.2), OA_CC3 (C11C.1 U1C.2), Power (5 pins), DCVoltageConditioning (C53.1 U10.2)
AnSig4_N: TopSheet (X1.A2), DCVoltageConditioning (C50.2 C51.1 R37.2)
AnSig4_P: TopSheet (X1.A1), DCVoltageConditioning (C49.2 C50.1 R35.2)
AnSig_N: TopSheet (X1.A5), OA_CC2 (C8B.2 C9B.1 R6B.2)
AnSig_N: TopSheet (X1.A6), OA_CC3 (C8C.2 C9C.1 R6C.2)
AnSig_N: TopSheet (X1.A8), OA_CC1 (C8A.2 C9A.1 R6A.2)
AnSig_P: TopSheet (X1.A3), OA_CC3 (C7C.2 C8C.1 R4C.2)
AnSig_P: TopSheet (X1.A4), OA_CC2 (C7B.2 C8B.1 R4B.2)
AnSig_P: TopSheet (X1.A7), OA_CC1 (C7A.2 C8A.1 R4A.2)
FANx_OUT: Connector_Inverter (J1.105 J1.107), GateAndFanControl (U11.1 U11.3), OvercurrentDetectionLogic (U12.11)
Gate_Enable: R7 (U2G.6), OvercurrentDetectionLogic (U12.13 U14.6)
GD_DIS: Connector_Inverter (J1.74), GateAndFanControl (U11.6)
OC_latched: T2 (R13B.1 U3B.1 U3B.3), OvercurrentDetectionLogic (R39.2 U14.5)
OpAinSig1: Connector_Inverter (J1.33), OA_CC1 (R5A.1), OvercurrentDetection (X3.01)
OpAinSig2: Connector_Inverter (J1.37), OA_CC2 (R5B.1), OvercurrentDetection (X3.03)
OpAinSig3: Connector_Inverter (J1.39), OA_CC3 (R5C.1), OvercurrentDetection (X3.05)
OpAinSig4: Connector_Inverter (J1.27), DCVoltageConditioning (R36.1)
ReceiverSig1: Connector_Inverter (J1.49), R1 (U2A.6)
ReceiverSig2: Connector_Inverter (J1.51), R2 (U2B.6)
ReceiverSig3: Connector_Inverter (J1.53), R3 (U2C.6)
ReceiverSig4: Connector_Inverter (J1.55), R4 (U2D.6)
ReceiverSig5: Connector_Inverter (J1.50), R5 (U2E.6)
ReceiverSig6: Connector_Inverter (J1.52), R6 (U2F.6)
TempSenseAnalog: Connector_Inverter (J1.36), TempSenseConditioning (R41.2)
TransmitterSig1: T1 (R13A.1 U3A.1 U3A.3), TempSenseConditioning (IC1.6)
U_HI_OC: OvercurrentDetection (C22.1 R20.2), OvercurrentDetectionLogic (U13.1)
U_LO_OC: OvercurrentDetection (C24.1 R22.2), OvercurrentDetectionLogic (U13.2)
V_HI_OC: OvercurrentDetection (C19.1 R14.2), OvercurrentDetectionLogic (U13.4)
V_LO_OC: OvercurrentDetection (C21.1 R19.2), OvercurrentDetectionLogic (U13.5)
W_HI_OC: OvercurrentDetection (C25.1 R23.2), OvercurrentDetectionLogic (U13.10)
W_LO_OC: OvercurrentDetection (C27.1 R25.2), OvercurrentDetectionLogic (U13.9)

## Assembly variants
default: all parts fitted
jlc: not fitted J2B J2D J2F J2G J3B